# Altium schematic sheet Power Circuit.SchDoc
size A4
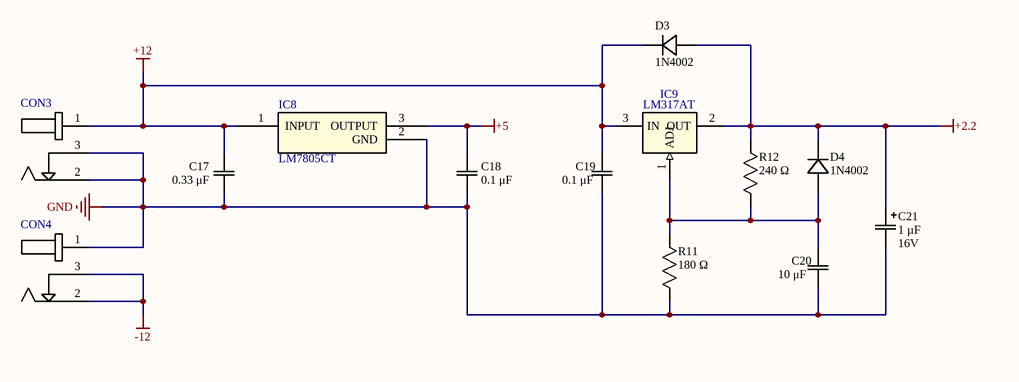
[diagram p0: Power Circuit.SchDoc]

## Parts
C17  value 0.33 μF  [CAP_1206J]  (hidden comment: 12062A270JAT2A)
C18  value 0.1 μF  [CAP_1206J]  (hidden comment: 12062A270JAT2A)
C19  value 0.1 μF  [CAP_1206J]  (hidden comment: 12062A270JAT2A)
C20  value 10 μF  [CAP_1206J]  (hidden comment: 12062A270JAT2A)
C21  value 1 µF  Voltage: 16V  [EEE-1C]  (hidden comment: EEE-1CA221UP)
CON3  DCJ250-10-A_XX-X_revA  [DCJ250-10-A_XX-X_revA]  (value not drawn)
CON4  DCJ250-10-A_XX-X_revA  [DCJ250-10-A_XX-X_revA]  (value not drawn)
D3  1N4002  [DO-204AL]
D4  1N4002  [DO-204AL]
IC8  LM7805CT  [TO-220]
IC9  LM317AT  [T03B]
R11  value 180 Ω  [RC1206N]  (hidden comment: RC1206JR-071M1L)
R12  value 240 Ω  [RC1206N]  (hidden comment: RC1206JR-071M1L)

## Nets
+2.2: C21.1 D3.2 D4.1 IC9.2(OUT) R12.1
+5: C18.2 IC8.3(OUTPUT)
+12: C17.2 C19.2 CON3.1 D3.1 IC8.1(INPUT) IC9.3(IN)
-12: CON4.2 CON4.3
GND: C17.1 C18.1 C19.1 C20.1 C21.2 CON3.2 CON3.3 CON4.1 IC8.2(GND) R11.2
NetC20_2: C20.2 D4.2 IC9.1(ADJ) R11.1 R12.2

## Library data of the parts
C17-C20 = 12062A270JAT2A: Imported; Built_By: EMA_UL_Team; Vendor: AVX Corporation; Type: DEV; Manufacturer_Part_Number: 12062A270JAT2A; RefDes: RefDes
C21 = EEE-1CA221UP: Imported; Vendor: Panasonic; Type: DEV; C: Copyright (C) 2015 Accelerated Designs. All rights reserved; Copyright: Copyright (C) 2015 Accelerated Designs. All rights reserved; Manufacturer_Part_Number: EEE-1CA221UP; RefDes: RefDes
CON3 CON4 = DCJ250-10-A_XX-X_revA: DC Power Jack, Thru-Hole, Horizontal, with Locating Pegs, D2.5mm
D3 D4 = 1N4002-E3/73: Imported; Vendor: Vishay; Built_By: EMA_UL_Team; Type: DEV; C: Copyright (C) 2015 Accelerated Designs. All rights reserved; Manufacturer_Part_Number: 1N4002-E3/73; RefDes: RefDes; Value: Value
IC8 = LM7805CT: Imported; Vendor: Fairchild Semiconductor; Built_By: EMA_UL_Team; C: Copyright (C) 2015 Accelerated Designs. All rights reserved; Manufacturer_Part_Number: LM7805CT; RefDes: RefDes; Type: DEV; Value: Value
IC9 = LM317AT: Imported; Vendor: Texas Instruments; Built_By: EMA_UL_Team; C: Copyright (C) 2015 Accelerated Designs. All rights reserved; Manufacturer_Part_Number: LM317AT; RefDes: RefDes; Type: DEV; Value: Value
R11 R12 = RC1206JR-071M1L: Imported; Vendor: Yageo; Built_By: EMA_UL_Team; C: Copyright (C) 2015 Accelerated Designs. All rights reserved; Manufacturer_Part_Number: RC1206JR-071M1L; RefDes: RefDes; Type: DEV